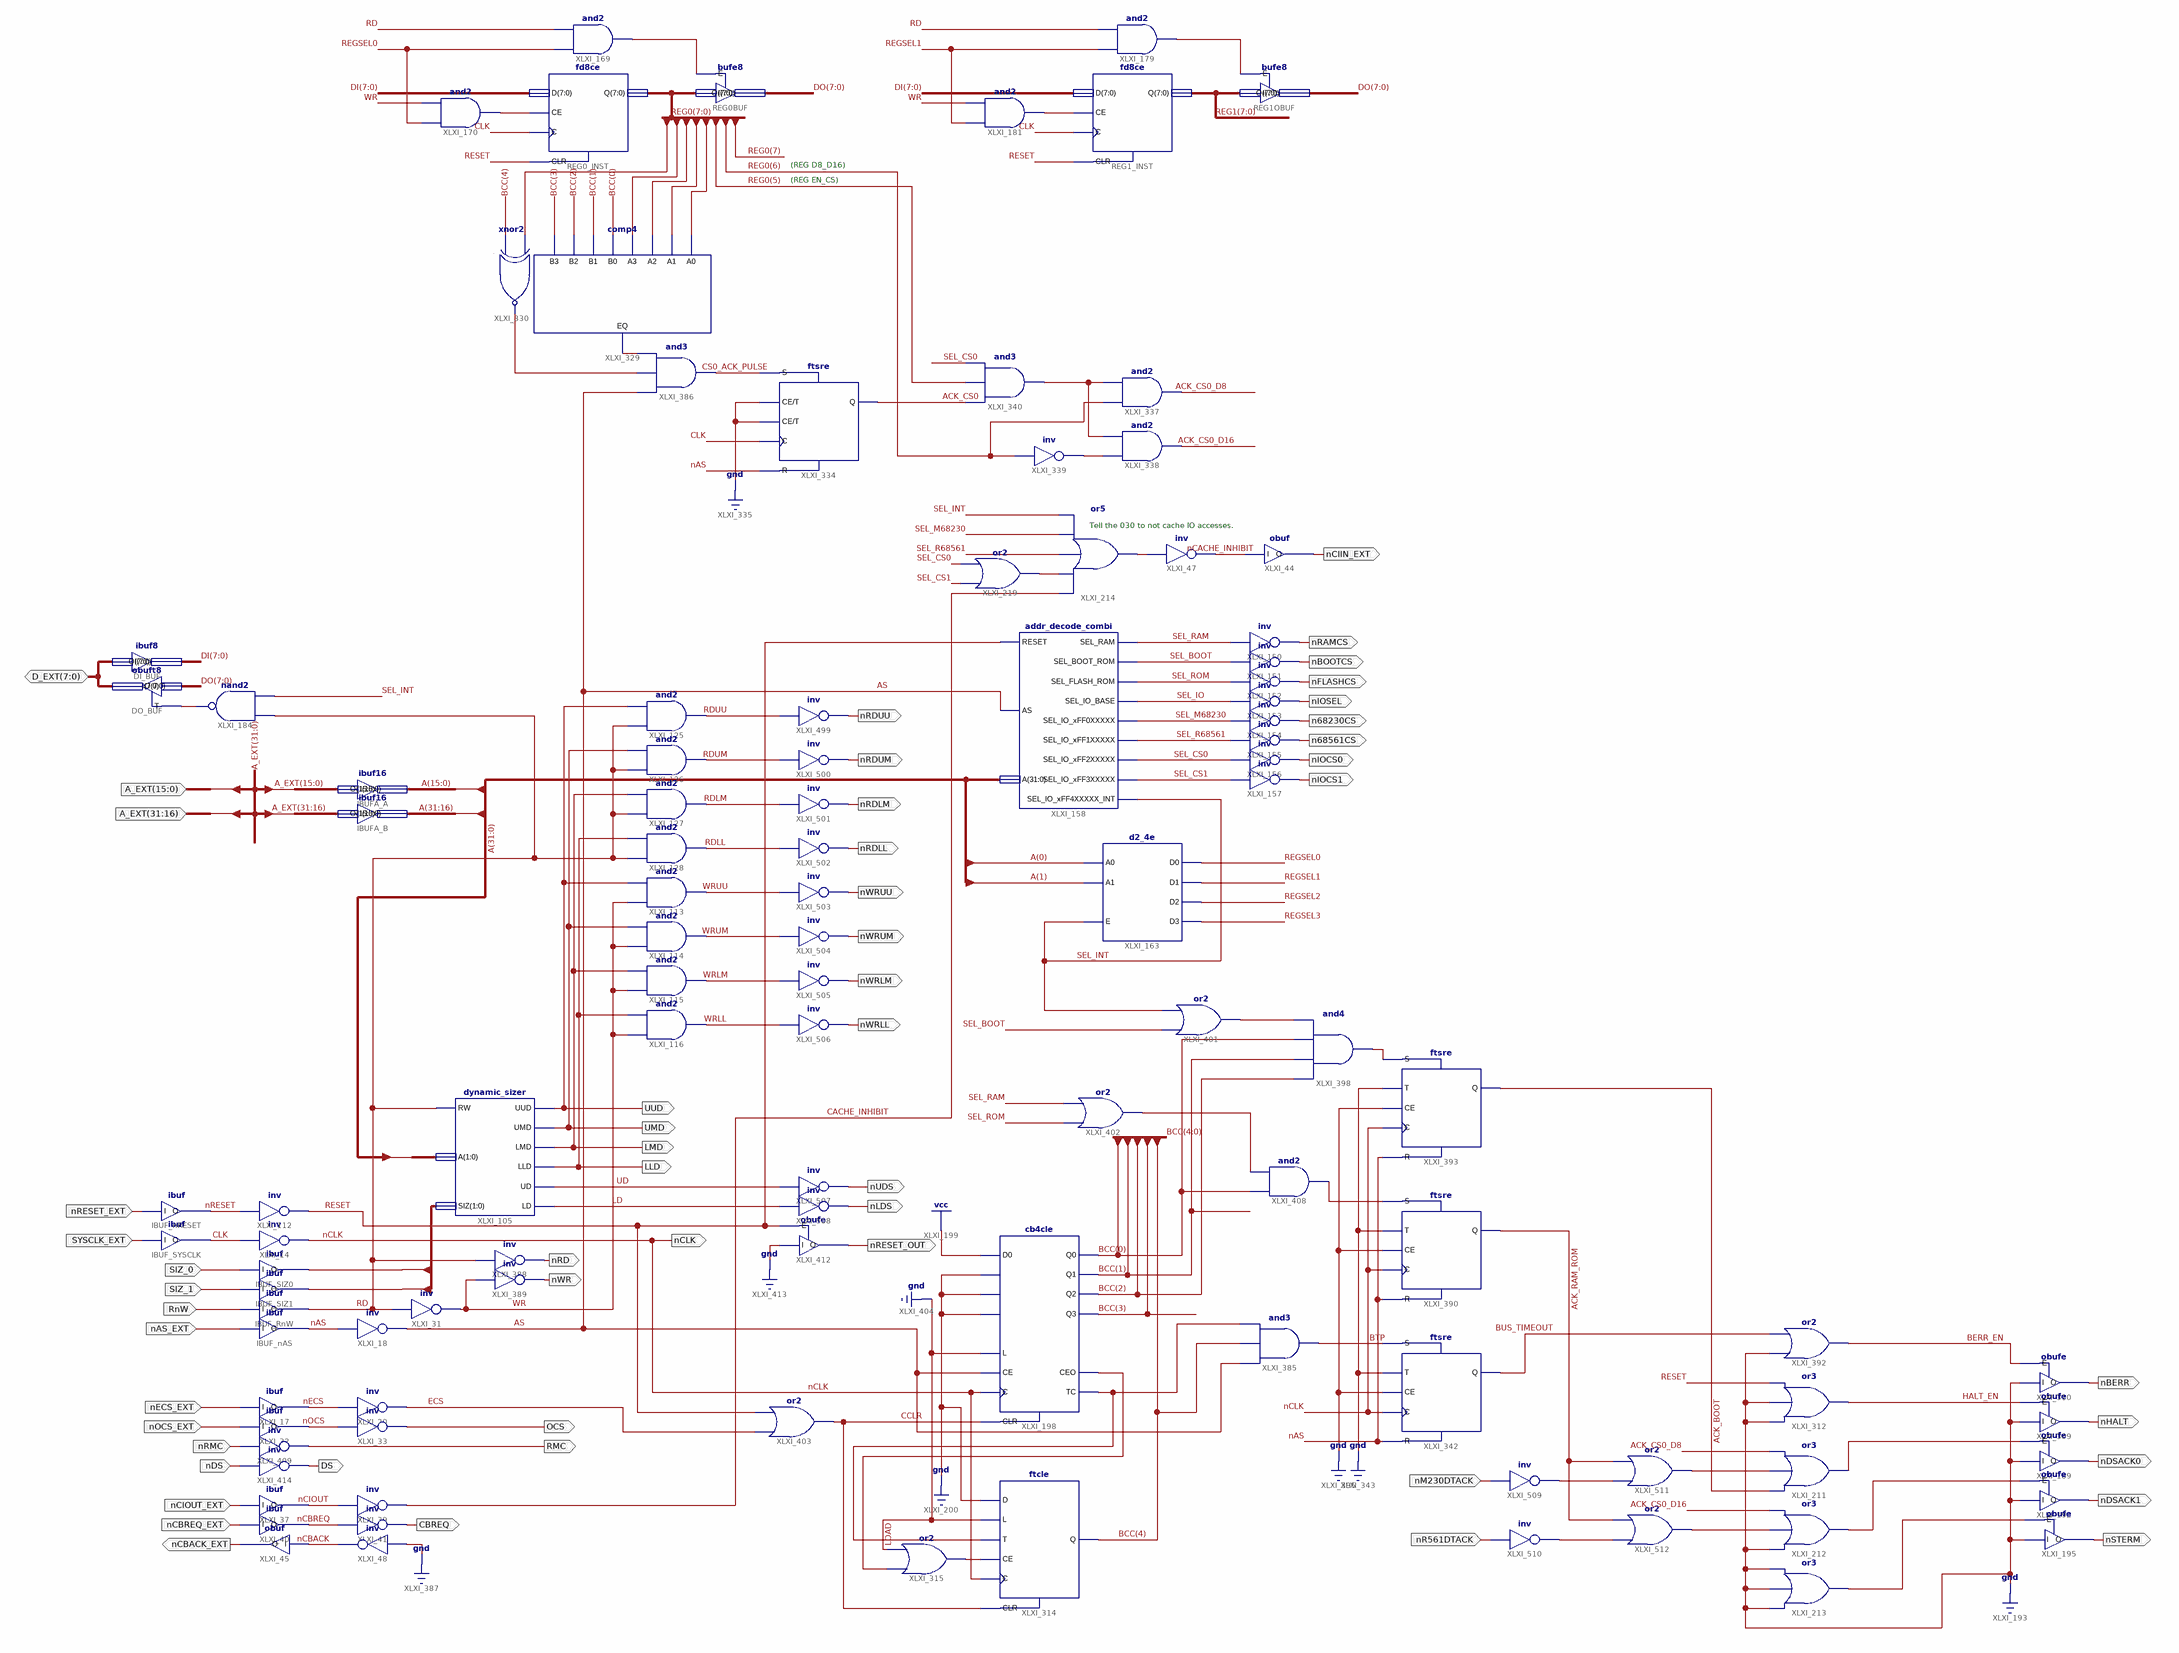
[diagram p0: schematic sheet 1]
// Xilinx ISE schematic top.sch (xc9500) as structural Verilog: 105 symbols, 54 ports
module top (
  input  SIZ_0,
  input  SIZ_1,
  input  RnW,
  input  nAS_EXT,
  input  nECS_EXT,
  input  nOCS_EXT,
  input  nCIOUT_EXT,
  input  nCBREQ_EXT,
  input  SYSCLK_EXT,
  input  nRESET_EXT,
  input  [31:0] A_EXT,
  input  nRMC,
  input  nDS,
  input  nM230DTACK,
  input  nR561DTACK,
  inout  [7:0] D_EXT,
  output nCBACK_EXT,
  output UUD,
  output UMD,
  output LMD,
  output LLD,
  output nDSACK0,
  output nDSACK1,
  output nSTERM,
  output OCS,
  output nHALT,
  output nBERR,
  output nRD,
  output nWR,
  output nCLK,
  output CBREQ,
  output RMC,
  output nRESET_OUT,
  output DS,
  output nRAMCS,
  output nBOOTCS,
  output nFLASHCS,
  output nIOSEL,
  output n68230CS,
  output n68561CS,
  output nIOCS0,
  output nIOCS1,
  output nCIIN_EXT,
  output nWRLL,
  output nWRLM,
  output nWRUM,
  output nWRUU,
  output nRDUU,
  output nRDUM,
  output nRDLM,
  output nRDLL,
  output nUDS,
  output nLDS
);

  wire ACK_BOOT, ACK_CS0, ACK_CS0_D8, ACK_CS0_D16, ACK_RAM_ROM, ACK_RAM_ROM_OR_R561DTACK, AS, BERR_EN, BTP,
       BUS_TIMEOUT, CACHE_INHIBIT, CCLR, CLK, CS0_ACK_PULSE, CS_CI, ECS, HALT_EN, LD, nAS, nCACHE_INHIBIT,
       nCBACK, nCBREQ, nCIOUT, nECS, nOCS, nRESET, RD, RDLL, RDLM, RDUM, RDUU, REGSEL0, REGSEL1, REGSEL2,
       REGSEL3, RESET, SEL_BOOT, SEL_CS0, SEL_CS1, SEL_INT, SEL_IO, SEL_M68230, SEL_R68561, SEL_RAM, SEL_ROM,
       UD, WR, WRLL, WRLM, WRUM, WRUU, XLXN_249, XLXN_252, XLXN_255, XLXN_276, XLXN_281, XLXN_310, XLXN_324,
       XLXN_325, XLXN_348, XLXN_649, XLXN_651, XLXN_655, XLXN_715, XLXN_716, XLXN_723, XLXN_724, XLXN_871,
       XLXN_887, XLXN_889, XLXN_893, XLXN_1106, XLXN_1107, XLXN_1109;
  wire [1:0] SIZ;
  wire [4:0] BCC;
  wire [7:0] DI, DO, REG0, REG1;
  wire [31:0] A;

  ibuf IBUF_RnW (.I(RnW), .O(RD));
  ibuf IBUF_nAS (.I(nAS_EXT), .O(nAS));
  not XLXI_18 (AS, nAS);
  ibuf XLXI_17 (.I(nECS_EXT), .O(nECS));
  not XLXI_20 (ECS, nECS);
  ibuf XLXI_32 (.I(nOCS_EXT), .O(nOCS));
  not XLXI_33 (OCS, nOCS);
  not XLXI_31 (WR, RD);
  ibuf XLXI_37 (.I(nCIOUT_EXT), .O(nCIOUT));
  not XLXI_39 (CACHE_INHIBIT, nCIOUT);
  ibuf XLXI_40 (.I(nCBREQ_EXT), .O(nCBREQ));
  not XLXI_41 (CBREQ, nCBREQ);
  obuf XLXI_45 (.I(nCBACK), .O(nCBACK_EXT));
  not XLXI_48 (nCBACK, 1'b0);
  dynamic_sizer XLXI_105 (.RW(RD), .A(A[1:0]), .SIZ(SIZ), .UUD(UUD), .UMD(UMD), .LMD(LMD), .LLD(LLD), .UD(UD), .LD(LD));
  and XLXI_113 (WRUU, WR, UUD);
  and XLXI_114 (WRUM, WR, UMD);
  and XLXI_115 (WRLM, WR, LMD);
  and XLXI_116 (WRLL, WR, LLD);
  ibuf IBUF_SIZ0 (.I(SIZ_0), .O(SIZ[0]));
  ibuf IBUF_SIZ1 (.I(SIZ_1), .O(SIZ[1]));
  ibuf16 IBUFA_A (.I(A_EXT[15:0]), .O(A[15:0]));
  ibuf16 IBUFA_B (.I(A_EXT[31:16]), .O(A[31:16]));
  ibuf IBUF_SYSCLK (.I(SYSCLK_EXT), .O(CLK));
  not XLXI_14 (nCLK, CLK);
  ibuf IBUF_nRESET (.I(nRESET_EXT), .O(nRESET));
  not XLXI_112 (RESET, nRESET);
  and XLXI_125 (RDUU, RD, UUD);
  and XLXI_126 (RDUM, RD, UMD);
  and XLXI_127 (RDLM, RD, LMD);
  and XLXI_128 (RDLL, RD, LLD);
  ibuf8 DI_BUF (.I(D_EXT), .O(DI));
  obuft8 #(.SLEW("FAST")) DO_BUF (.I(DO), .T(XLXN_249), .O(D_EXT));
  nand XLXI_184 (XLXN_249, SEL_INT, RD);
  cb4cle XLXI_198 (
    .C(nCLK), .CE(AS), .CLR(CCLR), .D0(1'b1), .D1(1'b0), .D2(1'b0), .D3(1'b0), .L(1'b0), .CEO(XLXN_651),
    .Q0(BCC[0]), .Q1(BCC[1]), .Q2(BCC[2]), .Q3(BCC[3]), .TC(XLXN_655));
  obufe XLXI_189 (.E(XLXN_310), .I(1'b0), .O(nDSACK0));
  obufe XLXI_192 (.E(XLXN_348), .I(1'b0), .O(nDSACK1));
  obufe XLXI_195 (.E(XLXN_324), .I(1'b0), .O(nSTERM));
  or XLXI_211 (XLXN_310, ACK_BOOT, XLXN_1107, ACK_CS0_D8);
  or XLXI_212 (XLXN_348, 1'b0, ACK_RAM_ROM_OR_R561DTACK, ACK_CS0_D16);
  or XLXI_213 (XLXN_324, 1'b0, 1'b0, 1'b0);
  bufe8 REG0BUF (.E(XLXN_255), .I(REG0), .O(DO));
  and XLXI_170 (XLXN_252, REGSEL0, WR);
  fd8ce REG0_INST (.C(CLK), .CE(XLXN_252), .CLR(RESET), .D(DI), .Q(REG0));
  and XLXI_169 (XLXN_255, REGSEL0, RD);
  bufe8 REG1OBUF (.E(XLXN_276), .I(REG1), .O(DO));
  and XLXI_181 (XLXN_281, REGSEL1, WR);
  fd8ce REG1_INST (.C(CLK), .CE(XLXN_281), .CLR(RESET), .D(DI), .Q(REG1));
  and XLXI_179 (XLXN_276, REGSEL1, RD);
  obufe XLXI_309 (.E(HALT_EN), .I(1'b0), .O(nHALT));
  obufe XLXI_310 (.E(BERR_EN), .I(1'b0), .O(nBERR));
  or XLXI_312 (HALT_EN, 1'b0, 1'b0, RESET);
  ftcle XLXI_314 (.C(nCLK), .CE(XLXN_649), .CLR(CCLR), .D(1'b0), .L(1'b0), .T(XLXN_655), .Q(BCC[4]));
  or XLXI_315 (XLXN_649, XLXN_651, 1'b0);
  comp4 XLXI_329 (
    .A0(REG0[0]), .A1(REG0[1]), .A2(REG0[2]), .A3(REG0[3]), .B0(BCC[0]), .B1(BCC[1]), .B2(BCC[2]),
    .B3(BCC[3]), .EQ(XLXN_715));
  xnor XLXI_330 (XLXN_716, BCC[4], REG0[4]);
  and XLXI_337 (ACK_CS0_D8, REG0[6], XLXN_723);
  and XLXI_338 (ACK_CS0_D16, XLXN_724, XLXN_723);
  not XLXI_339 (XLXN_724, REG0[6]);
  ftsre XLXI_334 (.C(CLK), .CE(1'b0), .R(nAS), .S(CS0_ACK_PULSE), .T(1'b0), .Q(ACK_CS0));
  and XLXI_340 (XLXN_723, ACK_CS0, REG0[5], SEL_CS0);
  ftsre XLXI_342 (.C(nCLK), .CE(1'b0), .R(nAS), .S(BTP), .T(1'b0), .Q(BUS_TIMEOUT));
  and XLXI_385 (BTP, AS, BCC[4], XLXN_655);
  and XLXI_386 (CS0_ACK_PULSE, AS, XLXN_716, XLXN_715);
  not XLXI_388 (nRD, RD);
  not XLXI_389 (nWR, WR);
  ftsre XLXI_390 (.C(nCLK), .CE(1'b0), .R(nAS), .S(XLXN_871), .T(1'b0), .Q(ACK_RAM_ROM));
  or XLXI_392 (BERR_EN, 1'b0, BUS_TIMEOUT);
  ftsre XLXI_393 (.C(nCLK), .CE(1'b0), .R(nAS), .S(XLXN_887), .T(1'b0), .Q(ACK_BOOT));
  and XLXI_398 (XLXN_887, BCC[2], BCC[1], BCC[0], XLXN_893);
  or XLXI_401 (XLXN_893, SEL_BOOT, SEL_INT);
  or XLXI_402 (XLXN_889, SEL_ROM, SEL_RAM);
  or XLXI_403 (CCLR, ECS, RESET);
  and XLXI_408 (XLXN_871, BCC[0], XLXN_889);
  not XLXI_409 (RMC, nRMC);
  obufe XLXI_412 (.E(RESET), .I(1'b0), .O(nRESET_OUT));
  not XLXI_414 (DS, nDS);
  or XLXI_219 (CS_CI, SEL_CS1, SEL_CS0);
  not XLXI_150 (nRAMCS, SEL_RAM);
  not XLXI_151 (nBOOTCS, SEL_BOOT);
  not XLXI_152 (nFLASHCS, SEL_ROM);
  not XLXI_153 (nIOSEL, SEL_IO);
  not XLXI_154 (n68230CS, SEL_M68230);
  not XLXI_155 (n68561CS, SEL_R68561);
  not XLXI_156 (nIOCS0, SEL_CS0);
  not XLXI_157 (nIOCS1, SEL_CS1);
  d2_4e XLXI_163 (.A0(A[0]), .A1(A[1]), .E(SEL_INT), .D0(REGSEL0), .D1(REGSEL1), .D2(REGSEL2), .D3(REGSEL3));
  addr_decode_combi XLXI_158 (
    .RESET(RESET), .AS(AS), .A(A), .SEL_RAM(SEL_RAM), .SEL_BOOT_ROM(SEL_BOOT), .SEL_FLASH_ROM(SEL_ROM),
    .SEL_IO_BASE(SEL_IO), .SEL_IO_xFF0XXXXX(SEL_M68230), .SEL_IO_xFF1XXXXX(SEL_R68561),
    .SEL_IO_xFF2XXXXX(SEL_CS0), .SEL_IO_xFF3XXXXX(SEL_CS1), .SEL_IO_xFF4XXXXX_INT(SEL_INT));
  or XLXI_214 (XLXN_325, CACHE_INHIBIT, CS_CI, SEL_R68561, SEL_M68230, SEL_INT);
  not XLXI_47 (nCACHE_INHIBIT, XLXN_325);
  obuf XLXI_44 (.I(nCACHE_INHIBIT), .O(nCIIN_EXT));
  not XLXI_499 (nRDUU, RDUU);
  not XLXI_500 (nRDUM, RDUM);
  not XLXI_501 (nRDLM, RDLM);
  not XLXI_502 (nRDLL, RDLL);
  not XLXI_503 (nWRUU, WRUU);
  not XLXI_504 (nWRUM, WRUM);
  not XLXI_505 (nWRLM, WRLM);
  not XLXI_506 (nWRLL, WRLL);
  not XLXI_507 (nUDS, UD);
  not XLXI_508 (nLDS, LD);
  not XLXI_509 (XLXN_1106, nM230DTACK);
  not XLXI_510 (XLXN_1109, nR561DTACK);
  or XLXI_511 (XLXN_1107, XLXN_1106, ACK_RAM_ROM);
  or XLXI_512 (ACK_RAM_ROM_OR_R561DTACK, XLXN_1109, ACK_RAM_ROM);

  // Notes on the sheet:
  //   (REG D8_D16)
  //   (REG EN_CS)
  //   Tell the 030 to not cache IO accesses.
  //   LOC on signal nRESET_EXT = P99
  //   SLEW on signal D_EXT(7:0) = FAST
  //   LOC on signal nDSACK0 = P6
  //   LOC on signal nDSACK1 = P7
  //   LOC on signal nSTERM = P8
  //   LOC on signal nHALT = P9
  //   LOC on signal nBERR = P10
endmodule
